# Altium schematic sheet POWERBUDGET.SchDoc: Power Budget
size 420 x 297 mm; SheetNumber: 8
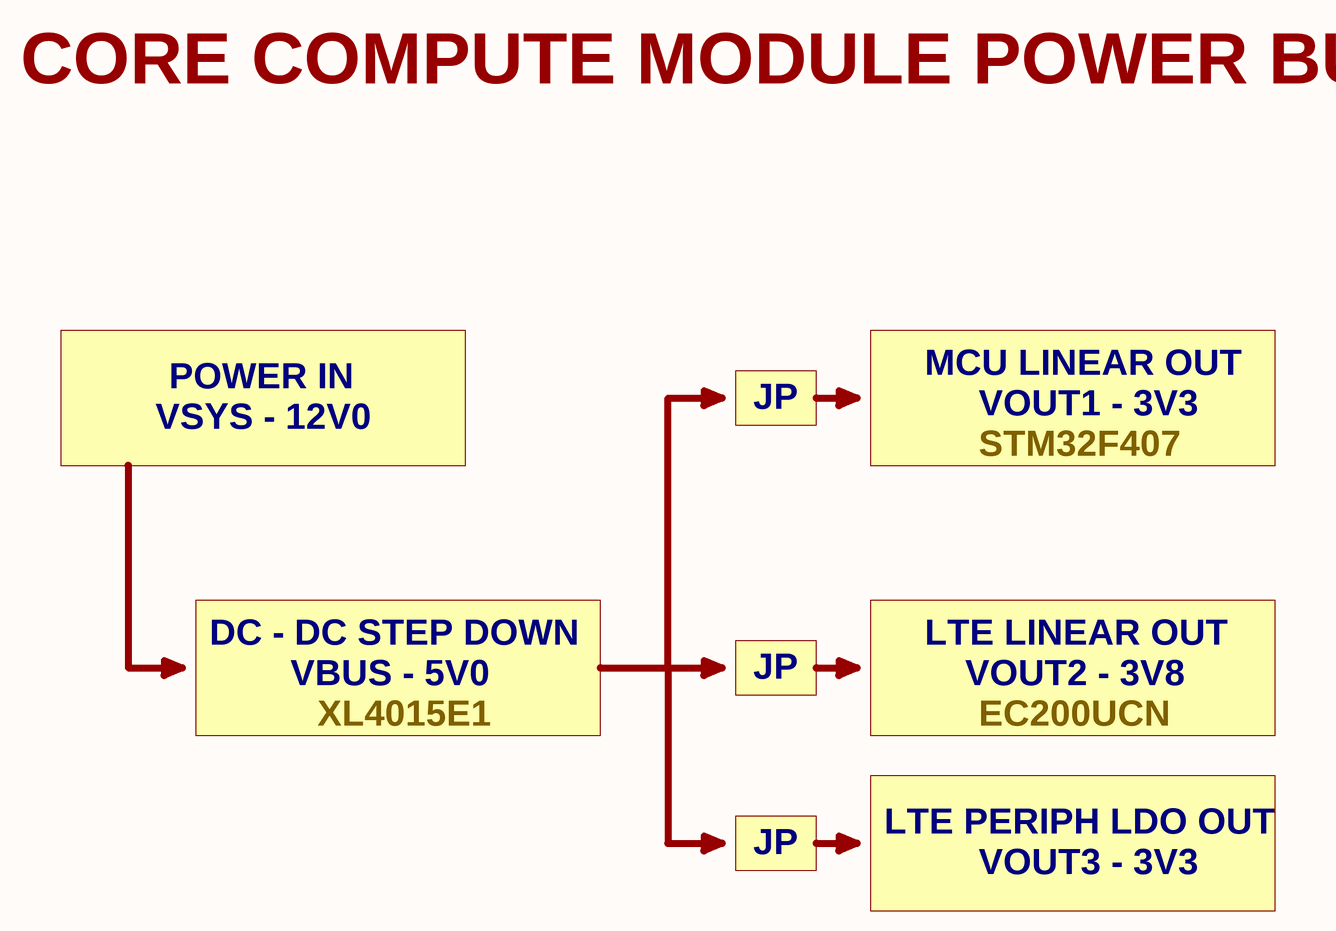
[diagram p0: POWERBUDGET.SchDoc]

## Notes on the sheet
- CORE COMPUTE MODULE POWER BUDGET
- POWER IN
- JP
- MCU LINEAR OUT
- VOUT1 - 3V3
- VSYS - 12V0
- STM32F407
- DC - DC STEP DOWN
- VBUS - 5V0
- LTE LINEAR OUT
- VOUT2 - 3V8
- XL4015E1
- EC200UCN
- LTE PERIPH LDO OUT
- VOUT3 - 3V3
- PROJECT
- SIZE
- FILE NAME
- A3
- TITLE
- SHEET
- OF
- REV